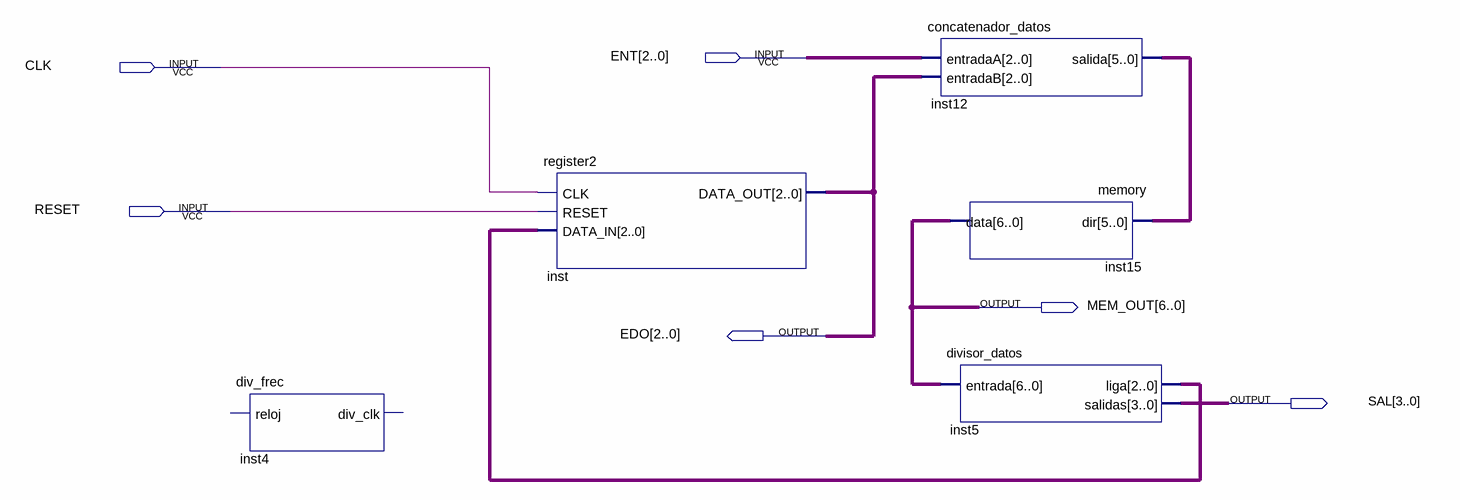
[diagram p0: schematic sheet]
// Quartus schematic practica_3.bdf as structural Verilog: 5 symbols, 6 pins
module practica_3 (
  input  [2:0] ENT,
  input  CLK,
  input  RESET,
  output [6:0] MEM_OUT,
  output [2:0] EDO,
  output [3:0] SAL
);

  wire [2:0] inst5_liga;
  wire [5:0] inst12_salida;

  div_frec inst4 ();  // open: reloj, div_clk
  register2 inst (.CLK(CLK), .RESET(RESET), .DATA_IN(inst5_liga), .DATA_OUT(EDO));
  concatenador_datos inst12 (.entradaA(ENT), .entradaB(EDO), .salida(inst12_salida));
  memory inst15 (.dir(inst12_salida), .data(MEM_OUT));
  divisor_datos inst5 (.entrada(MEM_OUT), .liga(inst5_liga), .salidas(SAL));
endmodule
